# EAGLE design LEDBoard (EAGLE 6.4)
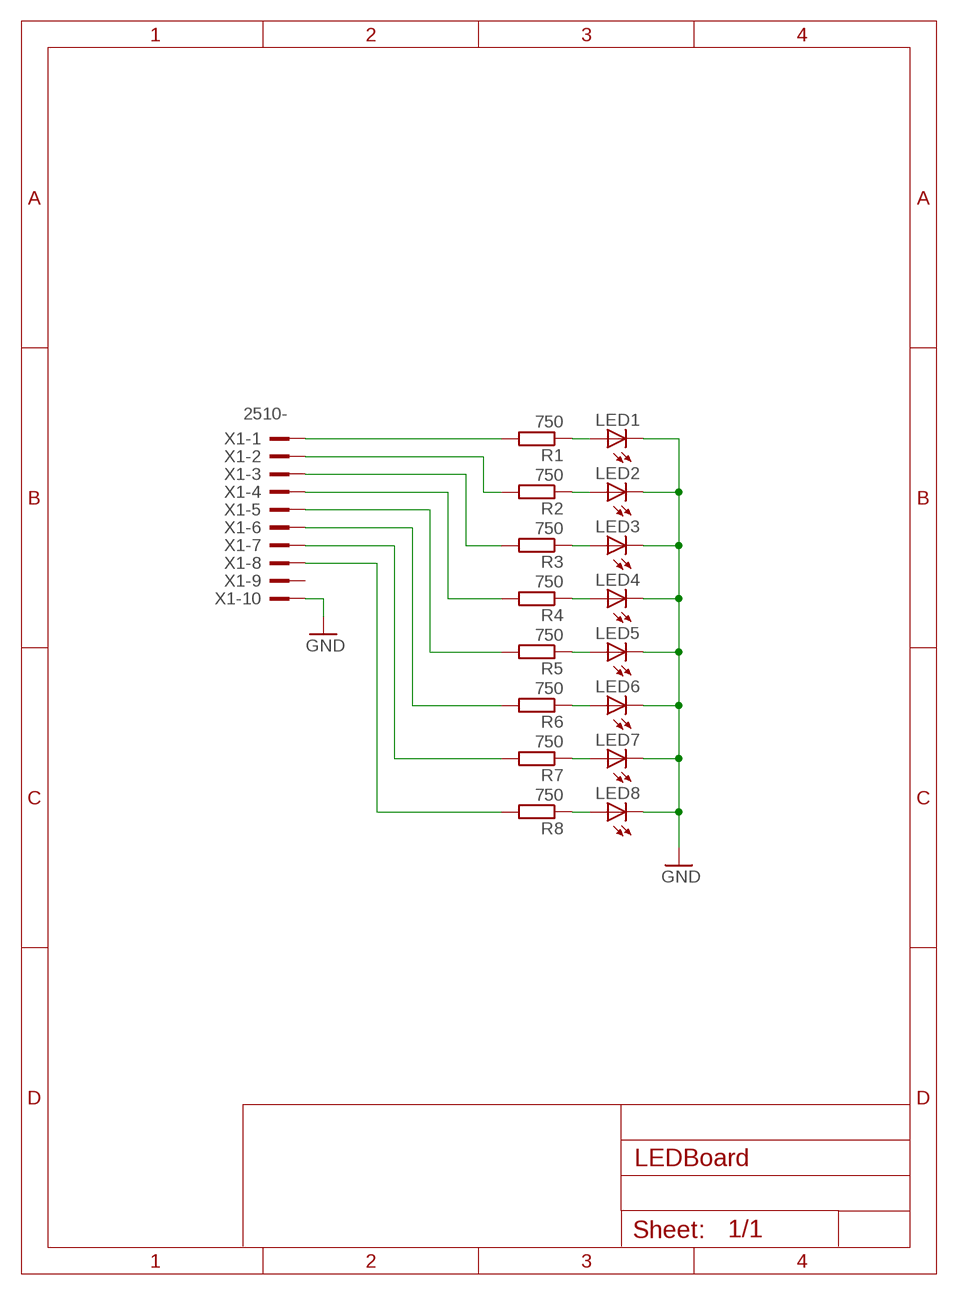
[diagram p0: schematic, sheet 1]

## Parts
LED1  LED3MM  [LED3MM]
LED2  LED3MM  [LED3MM]
LED3  LED3MM  [LED3MM]
LED4  LED3MM  [LED3MM]
LED5  LED3MM  [LED3MM]
LED6  LED3MM  [LED3MM]
LED7  LED3MM  [LED3MM]
LED8  LED3MM  [LED3MM]
R1  750  R-EU_R1206  [R1206]
R2  750  R-EU_R1206  [R1206]
R3  750  R-EU_R1206  [R1206]
R4  750  R-EU_R1206  [R1206]
R5  750  R-EU_R1206  [R1206]
R6  750  R-EU_R1206  [R1206]
R7  750  R-EU_R1206  [R1206]
R8  750  R-EU_R1206  [R1206]
X1  2510-  [PAK100/2500-10]

## Nets
GND: LED1.K(C) LED2.K(C) LED3.K(C) LED4.K(C) LED5.K(C) LED6.K(C) LED7.K(C) LED8.K(C) X1.10
N$1: R1.2 X1.1
N$2: R2.2 X1.2
N$3: R3.2 X1.3
N$4: R4.2 X1.4
N$5: R5.2 X1.5
N$6: R6.2 X1.6
N$7: R7.2 X1.7
N$8: R8.2 X1.8
N$9: LED1.A R1.1
N$10: LED2.A R2.1
N$11: LED3.A R3.1
N$12: LED4.A R4.1
N$13: LED5.A R5.1
N$14: LED6.A R6.1
N$15: LED7.A R7.1
N$16: LED8.A R8.1
Unconnected: X1.9

## Library data of the parts
LED1-LED8 = led:LED: LED OSRAM: - CHIPLED LG R971, LG N971, LY N971, LG Q971, LY Q971, LO R971, LY R971 LH N974, LH R974 LS Q976, LO Q976, LY Q976 LO Q996 - Hyper CHIPLED LW Q18S LB Q993, LB Q99A, LB R99A - SideLED LS A670, LO A670, LY A670, LG A670, LP A670 LB A673, LV A673, LT A673, LW A673 LH A674 LY A675 LS A676, LA A676, LO A676, LY A676, LW A676 LS A679, LY A679, LG A679 - Hyper Micro SIDELED® LS Y876, LA Y876, LO Y876, LY Y876 LT Y87S - SmartLED LW L88C, LW L88S LB L89C, LB L89S, LG L890 LS L89K, LO L89K, LY L89K LS L896, LA L896, LO L896, LY L896 - TOPLED LS T670, LO T670, LY T670, LG T670, LP T670 LSG T670, LSP T670, LSY T670, LOP T670, LYG T670 LG T671, LOG T671, LSG T671 LB T673, LV T673, LT T673, LW T673 LH T674 LS T676, LA T676, LO T676, LY T676, LB T676, LH T676, LSB T676, LW T676 LB T67C, LV T67C, LT T67C, LS T67K, LO T67K, LY T67K, LW E67C LS E67B, LA E67B, LO E67B, LY E67B, LB E67C, LV E67C, LT E67C LW T67C LS T679, LY T679, LG T679 LS T770, LO T770, LY T770, LG T770, LP T770 LB T773, LV T773, LT T773, LW T773 LH T774 LS E675, LA E675, LY E675, LS T675 LS T776, LA T776, LO T776, LY T776, LB T776 LHGB T686 LT T68C, LB T68C - Hyper Mini TOPLED® LB M676 - Mini TOPLED Santana® LG M470 LS M47K, LO M47K, LY M47K Source: http://www.osram.convergy.de LUXEON: - LUMILED® LXK2-PW12-R00, LXK2-PW12-S00, LXK2-PW14-U00, LXK2-PW14-V00 LXK2-PM12-R00, LXK2-PM12-S00, LXK2-PM14-U00 LXK2-PE12-Q00, LXK2-PE12-R00, LXK2-PE12-S00, LXK2-PE14-T00, LXK2-PE14-U00 LXK2-PB12-K00, LXK2-PB12-L00, LXK2-PB12-M00, LXK2-PB14-N00, LXK2-PB14-P00, LXK2-PB14-Q00 LXK2-PR12-L00, LXK2-PR12-M00, LXK2-PR14-Q00, LXK2-PR14-R00 LXK2-PD12-Q00, LXK2-PD12-R00, LXK2-PD12-S00 LXK2-PH12-R00, LXK2-PH12-S00 LXK2-PL12-P00, LXK2-PL12-Q00, LXK2-PL12-R00 Source: www.luxeon.com KINGBRIGHT: KA-3528ASYC Source: www.kingbright.com
R1-R8 = rcl:R-EU_: RESISTOR, European symbol
X1 = con-3m:2510-: 3M (TM) Pak 100 4-Wall Header Source: 3M; MF: 3M; MPN: 2510-6002UB; OC_FARNELL: 9838244; OC_NEWARK: 46F4725

## Board
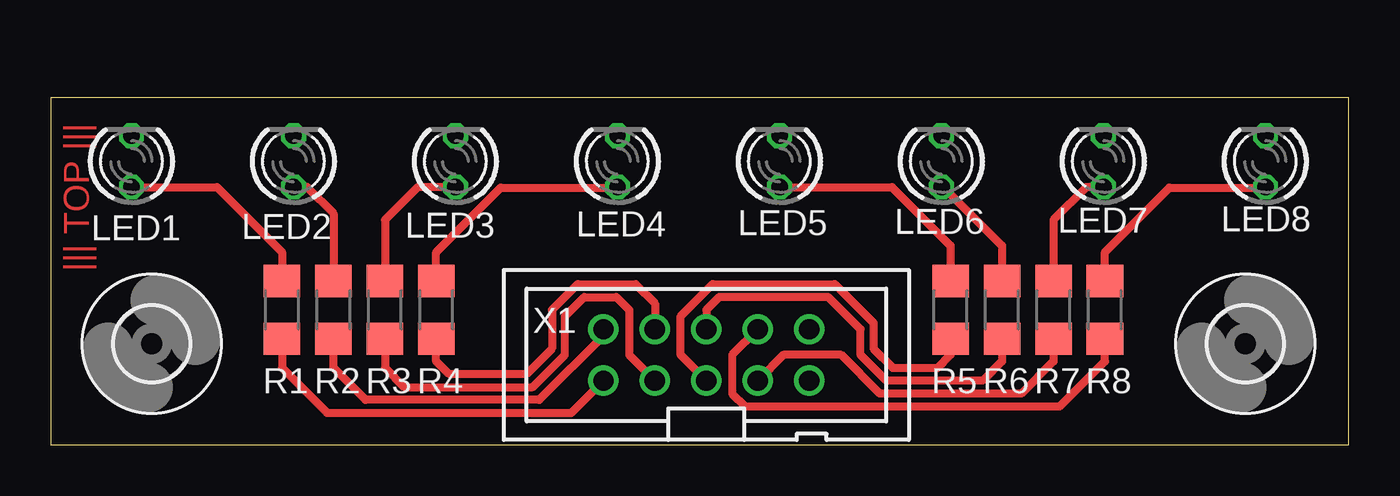
[diagram p1: board, top side]
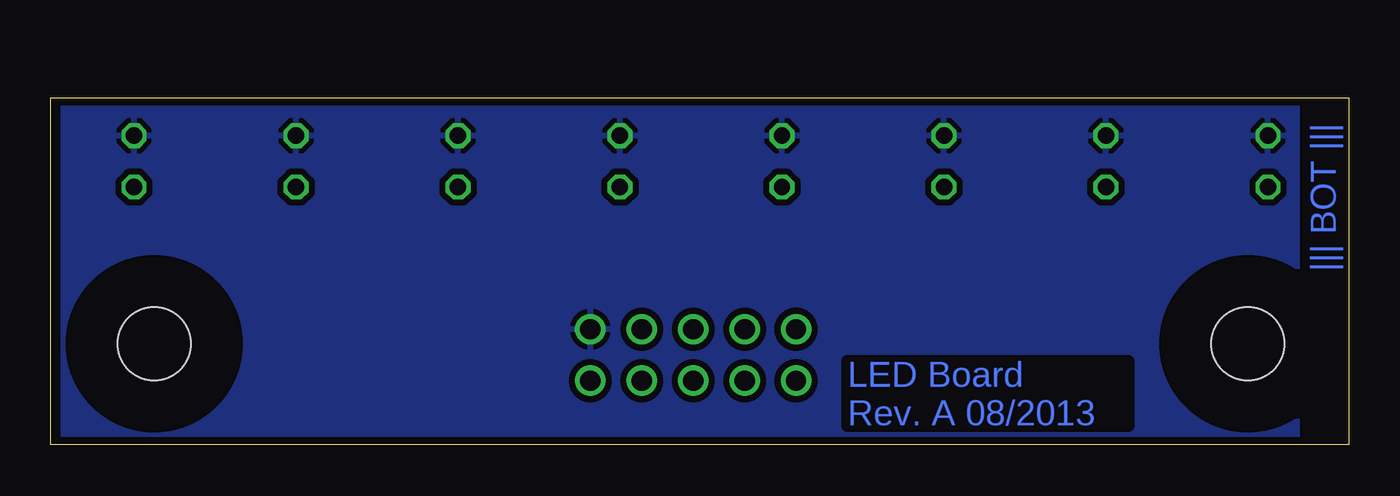
[diagram p2: board, bottom side, seen from below]

Size 64.12 x 17.14 mm. Coordinates in mm from the lower left corner, seen from the top.
Outline: 0,0 64.12,0 64.12,17.14 0,17.14 0,0
Copper layers (1*16): Top 0.0356mm / dielectric 1.5011mm / Bottom 0.0356mm
Design rules "LaenPCBOrder": minimum track width 6mil, minimum drill 13mil, track to track 6mil, track to pad 6mil, pad to pad 6mil, via to via 6mil, smd to smd 6mil, copper to edge 15mil, drill to drill 6mil, minimum pad ring 7mil, minimum via ring 7mil, stop-mask expansion 4mil, vias tented up to drill 0mil, thermal gap 10mil

### Footprints (pad centres in the part's own frame; a part is rotated, then mirrored left to right if it is on the bottom)
LED3MM = drill 0.813 octagon: A -1.27,0; K 1.27,0
R1206 = smd 1.6 x 1.803: 1 -1.422,0; 2 1.422,0
3,6 = hole 3.6: 0,0
PAK100/2500-10 = drill 1 pad 1.422: 1 -5.08,-1.27; 2 -5.08,1.27; 3 -2.54,-1.27; 4 -2.54,1.27; 5 0,-1.27; 6 0,1.27; 7 2.54,-1.27; 8 2.54,1.27; 9 5.08,-1.27; 10 5.08,1.27

### Placement (x,y rotation side)
LED1  4,14 90 top
LED2  12,14 90 top
LED3  20,14 90 top
LED4  28,14 90 top
LED5  36,14 90 top
LED6  44,14 90 top
LED7  52,14 90 top
LED8  60,14 90 top
R1  11.43,6.67 270 top
R2  13.97,6.67 270 top
R3  16.51,6.67 270 top
R4  19.05,6.67 270 top
R5  44.45,6.67 270 top
R6  46.99,6.67 270 top
R7  49.53,6.67 270 top
R8  52.07,6.67 270 top
U$1  [3,6]  5,5 0 top
U$2  [3,6]  59,5 0 top
X1  32.38,4.45 0 top

### Tracks (layer width: path | path; a pad name or v marks a point on that pad's centre or on a via)
GND
  pour Bottom (isolate 0.305): 2.54,16.83 63.5,16.83 63.5,0.32 2.54,0.32
N$1
  Top 0.406: R1.2 11.43,3.81 13.65,1.59 25.72,1.59 X1.1
N$2
  Top 0.406: X1.2 27.3,5.4 24.13,2.22 15.56,2.22 13.97,3.81 R2.2
N$3
  Top 0.406: R3.2 16.51,3.81 17.46,2.86 23.81,2.86 25.4,4.45 25.4,6.35 26.35,7.3 27.94,7.3 28.57,6.67 28.57,4.45 X1.3
N$4
  Top 0.406: X1.4 29.84,6.99 28.89,7.94 26.04,7.94 24.77,6.67 24.77,4.76 23.5,3.49 19.68,3.49 19.05,4.13 R4.2
N$5
  Top 0.406: X1.5 31.11,4.45 31.11,6.35 32.7,7.94 38.73,7.94 40.64,6.03 40.64,4.76 41.59,3.81 43.81,3.81 44.45,4.45 R5.2
N$6
  Top 0.406: R6.2 46.99,4.13 46.04,3.17 41.27,3.17 40.01,4.45 40.01,5.71 38.42,7.3 33.02,7.3 32.38,6.67 X1.6
N$7
  Top 0.406: R7.2 49.53,4.13 47.94,2.54 40.96,2.54 39.05,4.45 36.2,4.45 X1.7
N$8
  Top 0.406: X1.8 33.66,4.45 33.66,2.54 34.29,1.91 49.85,1.91 52.07,4.13 R8.2
N$9
  Top 0.406: LED1.A 8.22,12.73 11.43,9.53 R1.1
N$10
  Top 0.406: LED2.A 12.67,12.73 13.97,11.43 R2.1
N$11
  Top 0.406: LED3.A 18.13,12.73 16.51,11.11 R3.1
N$12
  Top 0.406: R4.1 19.05,9.53 22.23,12.7 27.97,12.7 LED4.A
N$13
  Top 0.406: LED5.A 41.56,12.73 44.45,9.84 R5.1
N$14
  Top 0.406: LED6.A 44.1,12.73 46.99,9.84 R6.1
N$15
  Top 0.406: LED7.A 51.15,12.73 49.53,11.11 R7.1
N$16
  Top 0.406: R8.1 52.07,9.53 55.24,12.7 59.97,12.7 LED8.A

### Text on the board
Top: ||| TOP |||
Bottom: ||| BOT ||| | LED Board / Rev. A 08/2013